# Altium schematic sheet power_supply.SchDoc
size A; SheetNumber: 2; SheetTotal: 12
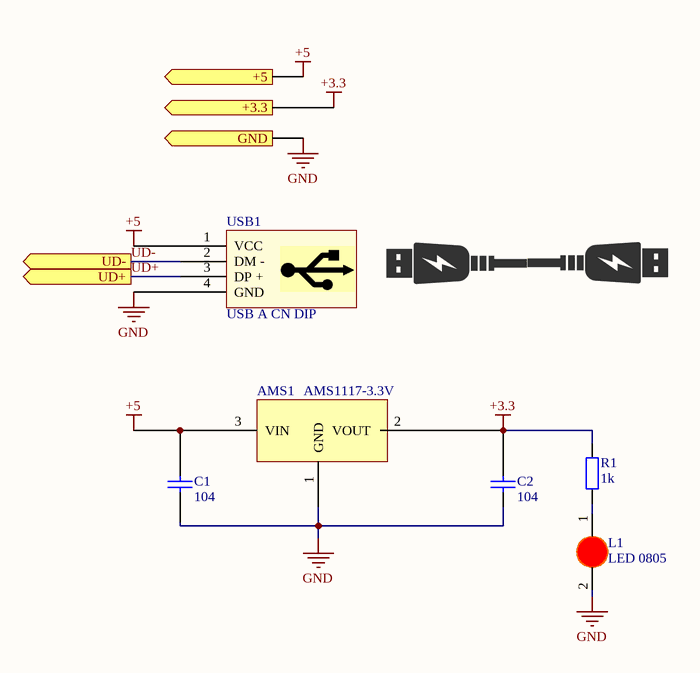
[diagram p0: power_supply.SchDoc]

## Parts
AMS1  AMS1117-3.3V  [SOT223]
C1  104  [tu 0603]
C2  104  [tu 0603]
L1  LED 0805  [LED-0805-Red]
R1  1k  [tro smd 0805]
USB1  USB A CN DIP  [USB A CN DIP]

## Ports
+3.3 (out), +5 (out), GND (out), UD+ (out), UD- (out)

## Nets
+3.3: AMS1.2(VOUT) C2.1 R1.2 ; port +3.3
+5: AMS1.3(VIN) C1.1 USB1.1(VCC) ; port +5
GND: AMS1.1(GND) C1.2 C2.2 L1.2(K) USB1.4(GND) ; port GND
UD+: USB1.3(DP_+) ; port UD+
UD-: USB1.2(DM_-) ; port UD-
NetL1_1: L1.1(A) R1.1

## Library data of the parts
AMS1 = AMS1117 SMD: Dán; Value: AMS1117-3.3V SOT223; Don_Vi: Con; Ma_Hang: MH000596; Ghi_Chu: *; Kieu_Chan: *; Chung_Loai: Dán
C1 C2 = Tu 0603 104 50V 10%: Dán; Don_Vi: Con; So_Chan: 2; Ten_Linh_Kien: Tụ 0603 104-100nF 10% 50V; Ma_Hang: MH004568; Chung_Loai: Dán; Kieu_Chan: *
L1 = LED 0805 Do: Dán; Don_Vi: Con; Ma_Hang: MH000897; Ten_Linh_Kien: LED 0805 Màu Đỏ (Red); Ghi_Chu: *; Kieu_Chan: *; Chung_Loai: Dán
R1 = Tro 0805 1% 1k: Dán; Don_Vi: Con; So_Chan: 2; Ten_Linh_Kien: Trở 0805 1% 1k; Ma_Hang: MH005468; Chung_Loai: Dán; Kieu_Chan: *
USB1 = USB A CN DIP: USB Type A; Ten: USB A Cái DIP; Ma_Hang: MH000941